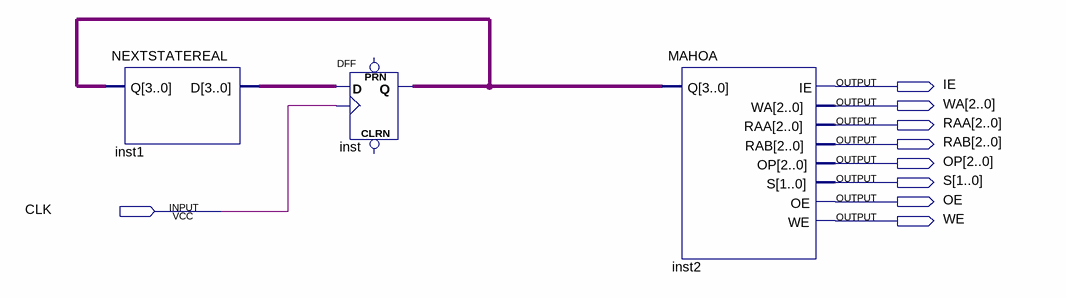
[diagram p0: schematic sheet]
// Quartus schematic NEXTSTATE.bdf as structural Verilog: 3 symbols, 9 pins
module NEXTSTATE (
  input  CLK,
  output IE,
  output [2:0] WA,
  output [2:0] RAA,
  output [2:0] RAB,
  output [2:0] OP,
  output [1:0] S,
  output OE,
  output WE
);

  wire [3:0] inst1_d, inst_q;

  NEXTSTATEREAL inst1 (.Q(inst_q), .D(inst1_d));
  DFF inst[3:0] (.CLK(CLK), .D(inst1_d), .Q(inst_q));  // open: CLRN, PRN
  MAHOA inst2 (.Q(inst_q), .IE(IE), .WA(WA), .RAA(RAA), .RAB(RAB), .OP(OP), .S(S), .OE(OE), .WE(WE));
endmodule
